# Altium schematic sheet TOP.SchDoc: =DocumentName
size A4; Organization: Queen's Formula SAE; Address1: 130 Stuart St, Kingston; Address2: Ontario; Address3: Canada; Address4: K7L 2V9; DocumentNumber: 1; Revision: 0; SheetNumber: 1; SheetTotal: 1
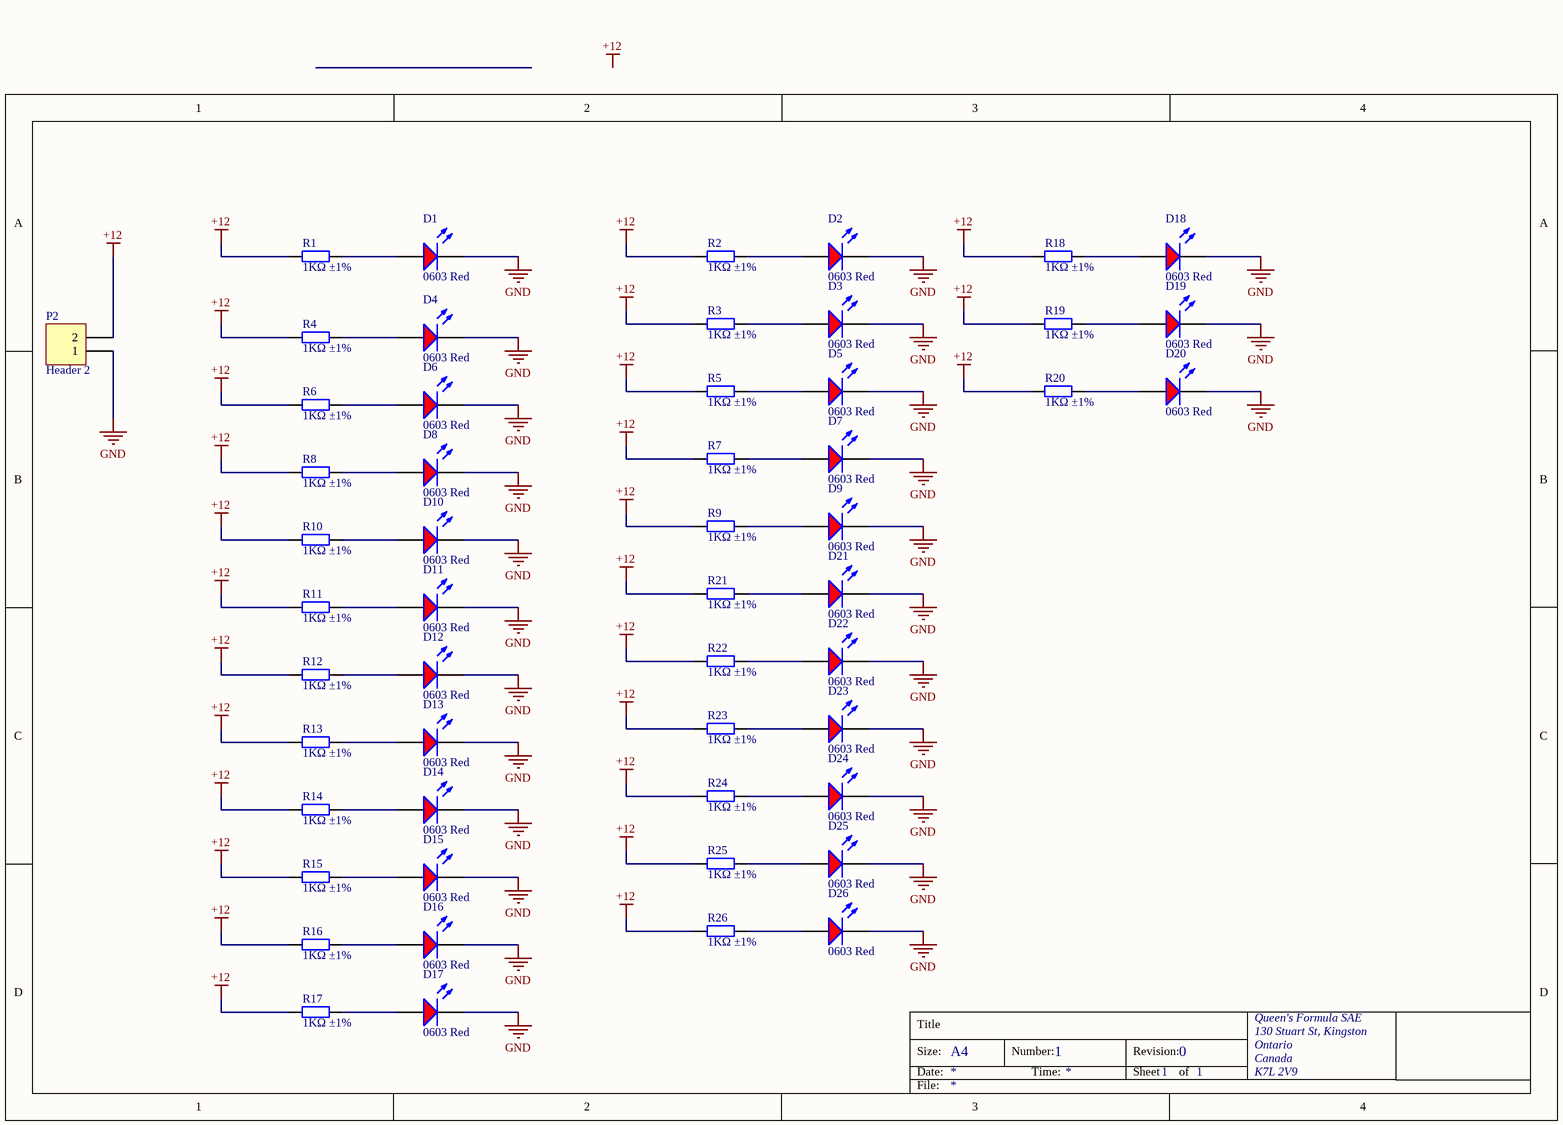
[diagram p0: TOP.SchDoc]

## Parts
D1  0603 Red  [0603_LED_S1]
D2  0603 Red  [0603_LED_S1]
D3  0603 Red  [0603_LED_S1]
D4  0603 Red  [0603_LED_S1]
D5  0603 Red  [0603_LED_S1]
D6  0603 Red  [0603_LED_S1]
D7  0603 Red  [0603_LED_S1]
D8  0603 Red  [0603_LED_S1]
D9  0603 Red  [0603_LED_S1]
D10  0603 Red  [0603_LED_S1]
D11  0603 Red  [0603_LED_S1]
D12  0603 Red  [0603_LED_S1]
D13  0603 Red  [0603_LED_S1]
D14  0603 Red  [0603_LED_S1]
D15  0603 Red  [0603_LED_S1]
D16  0603 Red  [0603_LED_S1]
D17  0603 Red  [0603_LED_S1]
D18  0603 Red  [0603_LED_S1]
D19  0603 Red  [0603_LED_S1]
D20  0603 Red  [0603_LED_S1]
D21  0603 Red  [0603_LED_S1]
D22  0603 Red  [0603_LED_S1]
D23  0603 Red  [0603_LED_S1]
D24  0603 Red  [0603_LED_S1]
D25  0603 Red  [0603_LED_S1]
D26  0603 Red  [0603_LED_S1]
P2  Header 2  [HDR1X2]
R1  1KΩ ±1%  [0603_R]
R2  1KΩ ±1%  [0603_R]
R3  1KΩ ±1%  [0603_R]
R4  1KΩ ±1%  [0603_R]
R5  1KΩ ±1%  [0603_R]
R6  1KΩ ±1%  [0603_R]
R7  1KΩ ±1%  [0603_R]
R8  1KΩ ±1%  [0603_R]
R9  1KΩ ±1%  [0603_R]
R10  1KΩ ±1%  [0603_R]
R11  1KΩ ±1%  [0603_R]
R12  1KΩ ±1%  [0603_R]
R13  1KΩ ±1%  [0603_R]
R14  1KΩ ±1%  [0603_R]
R15  1KΩ ±1%  [0603_R]
R16  1KΩ ±1%  [0603_R]
R17  1KΩ ±1%  [0603_R]
R18  1KΩ ±1%  [0603_R]
R19  1KΩ ±1%  [0603_R]
R20  1KΩ ±1%  [0603_R]
R21  1KΩ ±1%  [0603_R]
R22  1KΩ ±1%  [0603_R]
R23  1KΩ ±1%  [0603_R]
R24  1KΩ ±1%  [0603_R]
R25  1KΩ ±1%  [0603_R]
R26  1KΩ ±1%  [0603_R]

## Nets
+12: P2.2 R1.1 R2.1 R3.1 R4.1 R5.1 R6.1 R7.1 R8.1 R9.1 R10.1 R11.1 R12.1 R13.1 R14.1 R15.1 R16.1 R17.1 R18.1 R19.1 R20.1 R21.1 R22.1 R23.1 R24.1 R25.1 R26.1
GND: D1.K D2.K D3.K D4.K D5.K D6.K D7.K D8.K D9.K D10.K D11.K D12.K D13.K D14.K D15.K D16.K D17.K D18.K D19.K D20.K D21.K D22.K D23.K D24.K D25.K D26.K P2.1
NetD1_A: D1.A R1.2
NetD2_A: D2.A R2.2
NetD3_A: D3.A R3.2
NetD4_A: D4.A R4.2
NetD5_A: D5.A R5.2
NetD6_A: D6.A R6.2
NetD7_A: D7.A R7.2
NetD8_A: D8.A R8.2
NetD9_A: D9.A R9.2
NetD10_A: D10.A R10.2
NetD11_A: D11.A R11.2
NetD12_A: D12.A R12.2
NetD13_A: D13.A R13.2
NetD14_A: D14.A R14.2
NetD15_A: D15.A R15.2
NetD16_A: D16.A R16.2
NetD17_A: D17.A R17.2
NetD18_A: D18.A R18.2
NetD19_A: D19.A R19.2
NetD20_A: D20.A R20.2
NetD21_A: D21.A R21.2
NetD22_A: D22.A R22.2
NetD23_A: D23.A R23.2
NetD24_A: D24.A R24.2
NetD25_A: D25.A R25.2
NetD26_A: D26.A R26.2

## Notes on the sheet
- Labels drawn without touching a wire or pin: +12
- Title
- Size:
- Date:
- A4
- Number:
- Time:
- Revision:
- Sheet
- of
- File:

## Library data of the parts
D1-D26 = 0603 LED Red: LED; ComponentLink1Description: 供应商链接; ComponentLink1URL: http://www.szlcsc.com/product/details_2659.html; Package: 0603; Supplier: LC; SuppliersPartNumber: C2286; Color: Red
P2 = Header 2: Header, 2-Pin; LatestRevisionDate: 17-Jul-2002; LatestRevisionNote: Re-released for DXP Platform.; Publisher: Altium Limited
R1-R26 = 0603 1K (1001) 1%: Chip resistor; Manufacturer: Uniroyal Elec; PartNumber: 0603WAF1001T5E; Power: 1/10W; ComponentLink1Description: Supplier link; ComponentLink1URL: http://www.szlcsc.com/product/details_21904.html; Package: 0603; Supplier: LC; SuppliersPartNumber: C21190; Resistance: 1KΩ; Tolerance: 1%